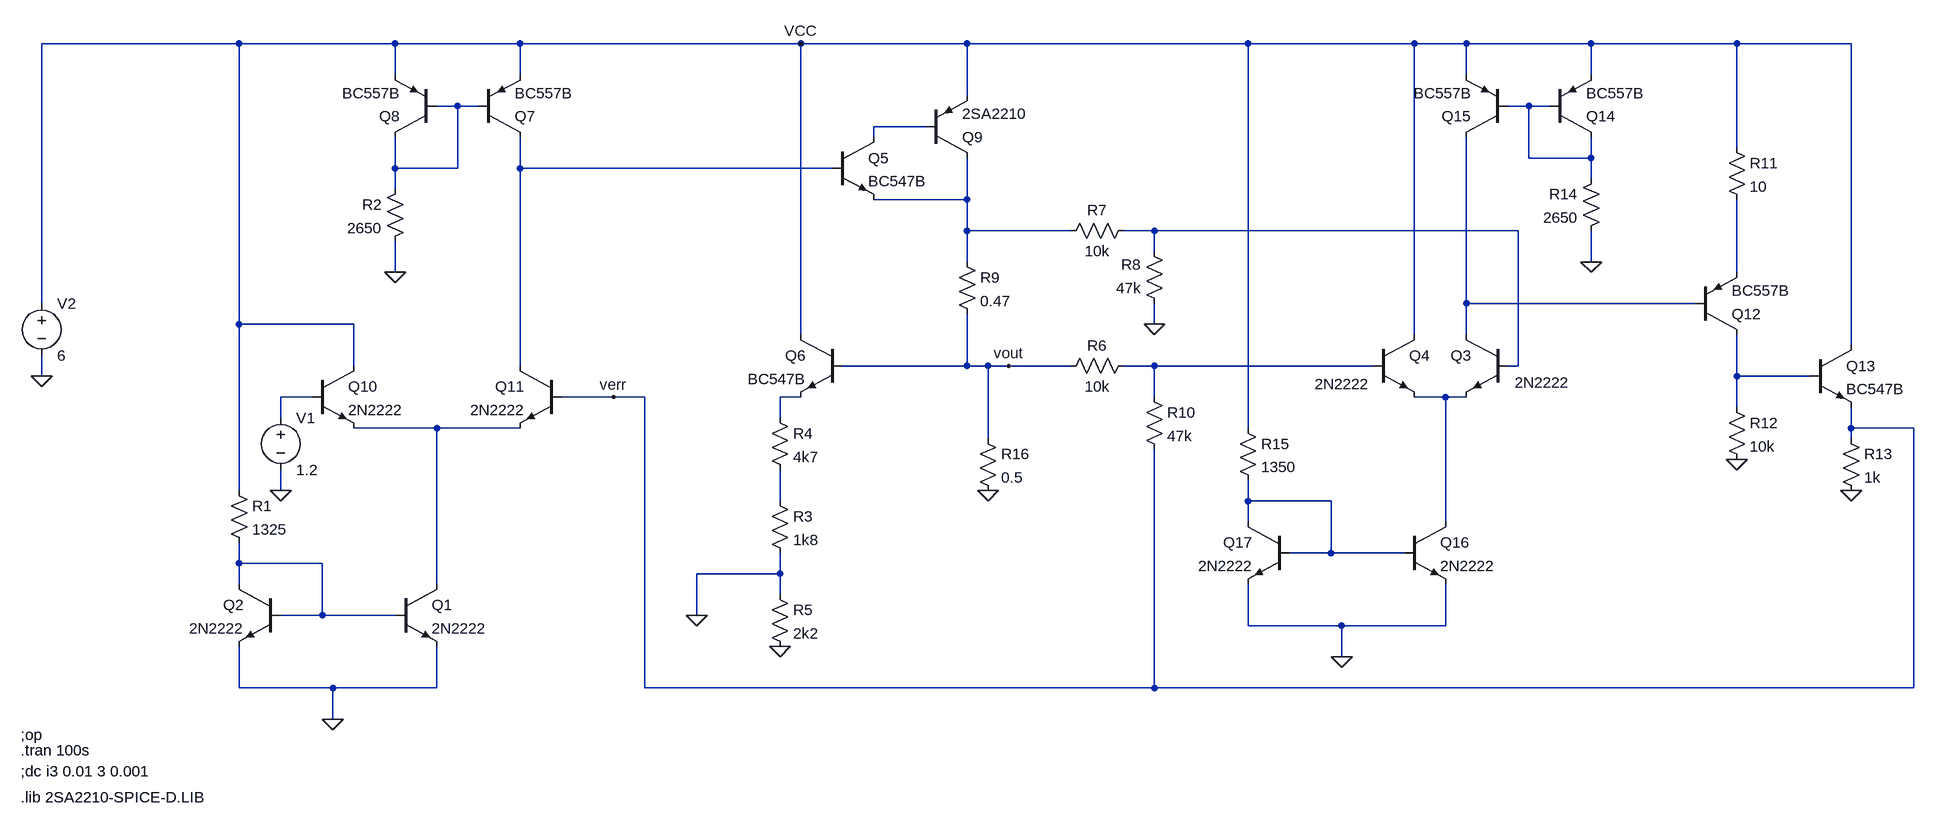
[diagram p0: schematic modelo_1_2_discrete.asc]
modelo_1_2_discrete.asc, the LTspice schematic file:
Version 4
SHEET 1 3060 680
WIRE -128 -496 -432 -496
WIRE 112 -496 -128 -496
WIRE 304 -496 112 -496
WIRE 736 -496 304 -496
WIRE 992 -496 736 -496
WIRE 1424 -496 992 -496
WIRE 1680 -496 1424 -496
WIRE 1760 -496 1680 -496
WIRE 1952 -496 1760 -496
WIRE 2176 -496 1952 -496
WIRE 2352 -496 2176 -496
WIRE 112 -448 112 -496
WIRE 304 -448 304 -496
WIRE 1760 -448 1760 -496
WIRE 1952 -448 1952 -496
WIRE 992 -416 992 -496
WIRE 208 -400 176 -400
WIRE 240 -400 208 -400
WIRE 1856 -400 1824 -400
WIRE 1888 -400 1856 -400
WIRE 928 -368 848 -368
WIRE 848 -352 848 -368
WIRE 2176 -336 2176 -496
WIRE 1856 -320 1856 -400
WIRE 1952 -320 1952 -352
WIRE 1952 -320 1856 -320
WIRE 112 -304 112 -352
WIRE 208 -304 208 -400
WIRE 208 -304 112 -304
WIRE 304 -304 304 -352
WIRE 784 -304 304 -304
WIRE 1952 -288 1952 -320
WIRE 112 -272 112 -304
WIRE 992 -256 992 -320
WIRE 992 -256 848 -256
WIRE 992 -208 992 -256
WIRE 1152 -208 992 -208
WIRE 1280 -208 1232 -208
WIRE 1840 -208 1280 -208
WIRE 1280 -176 1280 -208
WIRE 992 -160 992 -208
WIRE 1952 -160 1952 -208
WIRE 112 -144 112 -192
WIRE 2176 -144 2176 -256
WIRE -432 -96 -432 -496
WIRE 1760 -96 1760 -352
WIRE 2112 -96 1760 -96
WIRE -128 -64 -128 -496
WIRE 48 -64 -128 -64
WIRE 1280 -64 1280 -96
WIRE 736 -48 736 -496
WIRE 1680 -48 1680 -496
WIRE 1760 -48 1760 -96
WIRE 2352 -32 2352 -496
WIRE 48 0 48 -64
WIRE 304 0 304 -304
WIRE 992 0 992 -80
WIRE 992 0 800 0
WIRE 1024 0 992 0
WIRE 1056 0 1024 0
WIRE 1152 0 1056 0
WIRE 1280 0 1232 0
WIRE 1616 0 1280 0
WIRE 1840 0 1840 -208
WIRE 1840 0 1824 0
WIRE -432 16 -432 -16
WIRE 2176 16 2176 -48
WIRE 2288 16 2176 16
WIRE -16 48 -64 48
WIRE 448 48 368 48
WIRE 496 48 448 48
WIRE 736 48 704 48
WIRE 1280 48 1280 0
WIRE 1728 48 1680 48
WIRE 1760 48 1728 48
WIRE 2176 64 2176 16
WIRE -64 80 -64 48
WIRE 704 80 704 48
WIRE 176 96 48 96
WIRE 304 96 176 96
WIRE 1424 96 1424 -496
WIRE 2352 96 2352 64
WIRE 2448 96 2352 96
WIRE 1024 112 1024 0
WIRE 2352 112 2352 96
WIRE -128 192 -128 -64
WIRE -64 192 -64 160
WIRE 704 208 704 160
WIRE 1424 208 1424 176
WIRE 1552 208 1424 208
WIRE 1424 240 1424 208
WIRE 1728 240 1728 48
WIRE 1552 288 1552 208
WIRE 1552 288 1488 288
WIRE 1664 288 1552 288
WIRE -128 304 -128 272
WIRE 0 304 -128 304
WIRE 704 320 704 288
WIRE 704 320 576 320
WIRE -128 336 -128 304
WIRE 176 336 176 96
WIRE 704 352 704 320
WIRE 0 384 0 304
WIRE 0 384 -64 384
WIRE 112 384 0 384
WIRE 576 384 576 320
WIRE 1424 400 1424 336
WIRE 1568 400 1424 400
WIRE 1728 400 1728 336
WIRE 1728 400 1568 400
WIRE 1568 448 1568 400
WIRE -128 496 -128 432
WIRE 16 496 -128 496
WIRE 176 496 176 432
WIRE 176 496 16 496
WIRE 496 496 496 48
WIRE 1280 496 1280 128
WIRE 1280 496 496 496
WIRE 2448 496 2448 96
WIRE 2448 496 1280 496
WIRE 16 544 16 496
FLAG 16 544 0
FLAG -64 192 0
FLAG -432 16 0
FLAG 112 -144 0
FLAG 1056 0 vout
FLAG 448 48 verr
FLAG 1024 192 0
FLAG 704 432 0
FLAG 736 -496 VCC
FLAG 576 384 0
FLAG 1280 -64 0
FLAG 2176 144 0
FLAG 2352 192 0
FLAG 1952 -160 0
FLAG 1568 448 0
SYMBOL npn 112 336 R0
SYMATTR InstName Q1
SYMATTR Value 2N2222
SYMBOL npn -64 336 M0
SYMATTR InstName Q2
SYMATTR Value 2N2222
SYMBOL npn 784 -352 R0
SYMATTR InstName Q5
SYMATTR Value BC547B
SYMBOL pnp 240 -352 M180
SYMATTR InstName Q7
SYMATTR Value BC557B
SYMBOL pnp 176 -352 R180
SYMATTR InstName Q8
SYMATTR Value BC557B
SYMBOL res -144 176 R0
SYMATTR InstName R1
SYMATTR Value 1325
SYMBOL res 128 -288 M0
SYMATTR InstName R2
SYMATTR Value 2650
SYMBOL pnp 928 -320 M180
SYMATTR InstName Q9
SYMATTR Value 2SA2210
SYMBOL voltage -64 64 R0
WINDOW 123 0 0 Left 0
WINDOW 39 0 0 Left 0
SYMATTR InstName V1
SYMATTR Value 1.2
SYMBOL voltage -432 -112 R0
WINDOW 123 0 0 Left 0
WINDOW 39 0 0 Left 0
SYMATTR InstName V2
SYMATTR Value 6
SYMBOL npn 800 -48 M0
SYMATTR InstName Q6
SYMATTR Value BC547B
SYMBOL res 688 64 R0
SYMATTR InstName R4
SYMATTR Value 4k7
SYMBOL res 688 192 R0
SYMATTR InstName R3
SYMATTR Value 1k8
SYMBOL res 688 336 R0
SYMATTR InstName R5
SYMATTR Value 2k2
SYMBOL res 976 -176 R0
SYMATTR InstName R9
SYMATTR Value 0.47
SYMBOL npn -16 0 R0
SYMATTR InstName Q10
SYMATTR Value 2N2222
SYMBOL npn 368 0 M0
SYMATTR InstName Q11
SYMATTR Value 2N2222
SYMBOL res 1248 -16 R90
WINDOW 0 0 56 VBottom 2
WINDOW 3 32 56 VTop 2
SYMATTR InstName R6
SYMATTR Value 10k
SYMBOL res 1248 -224 R90
WINDOW 0 0 56 VBottom 2
WINDOW 3 32 56 VTop 2
SYMATTR InstName R7
SYMATTR Value 10k
SYMBOL res 1296 -80 R180
WINDOW 0 36 76 Left 2
WINDOW 3 36 40 Left 2
SYMATTR InstName R8
SYMATTR Value 47k
SYMBOL res 1264 32 R0
SYMATTR InstName R10
SYMATTR Value 47k
SYMBOL npn 1824 -48 M0
WINDOW 3 -95 74 Left 2
SYMATTR InstName Q3
SYMATTR Value 2N2222
SYMBOL npn 1616 -48 R0
WINDOW 3 -89 76 Left 2
SYMATTR InstName Q4
SYMATTR Value 2N2222
SYMBOL pnp 2112 -48 M180
SYMATTR InstName Q12
SYMATTR Value BC557B
SYMBOL res 2160 -352 R0
SYMATTR InstName R11
SYMATTR Value 10
SYMBOL res 2160 48 R0
SYMATTR InstName R12
SYMATTR Value 10k
SYMBOL npn 2288 -32 R0
SYMATTR InstName Q13
SYMATTR Value BC547B
SYMBOL res 2336 96 R0
SYMATTR InstName R13
SYMATTR Value 1k
SYMBOL pnp 1888 -352 M180
SYMATTR InstName Q14
SYMATTR Value BC557B
SYMBOL pnp 1824 -352 R180
SYMATTR InstName Q15
SYMATTR Value BC557B
SYMBOL res 1968 -304 M0
SYMATTR InstName R14
SYMATTR Value 2650
SYMBOL npn 1664 240 R0
SYMATTR InstName Q16
SYMATTR Value 2N2222
SYMBOL npn 1488 240 M0
SYMATTR InstName Q17
SYMATTR Value 2N2222
SYMBOL res 1408 80 R0
SYMATTR InstName R15
SYMATTR Value 1350
SYMBOL res 1008 96 R0
SYMATTR InstName R16
SYMATTR Value 0.5
TEXT -464 568 Left 2 !;op
TEXT -464 592 Left 2 !.tran 100s
TEXT -464 624 Left 2 !;dc i3 0.01 3 0.001
TEXT -464 664 Left 2 !.lib 2SA2210-SPICE-D.LIB

The netlist it stands for:
* modelo_1_2_discrete.asc
Q1 N014 N017 0 0 2N2222
Q2 N017 N017 0 0 2N2222
Q5 N003 N004 N005 0 BC547B
Q7 N004 N001 VCC 0 BC557B
Q8 N001 N001 VCC 0 BC557B
R1 VCC N017 1325
R2 N001 0 2650
Q9 N005 N003 VCC 0 2SA2210
V1 N011 0 1.2
V2 VCC 0 6
Q6 VCC vout N012 0 BC547B
R4 N012 N015 4k7
R3 N015 0 1k8
R5 0 0 2k2
R9 N005 vout 0.47
Q10 VCC N011 N014 0 2N2222
Q11 N004 verr N014 0 2N2222
R6 N009 vout 10k
R7 N006 N005 10k
R8 0 N006 47k
R10 N009 verr 47k
Q3 N008 N006 N013 0 2N2222
Q4 VCC N009 N013 0 2N2222
Q12 N010 N008 N007 0 BC557B
R11 VCC N007 10
R12 N010 0 10k
Q13 VCC N010 verr 0 BC547B
R13 verr 0 1k
Q14 N002 N002 VCC 0 BC557B
Q15 N008 N002 VCC 0 BC557B
R14 N002 0 2650
Q16 N013 N016 0 0 2N2222
Q17 N016 N016 0 0 2N2222
R15 VCC N016 1350
R16 vout 0 0.5
.model NPN NPN
.model PNP PNP
.lib standard.bjt
;op
.tran 100s
;dc i3 0.01 3 0.001
.lib 2SA2210-SPICE-D.LIB
.backanno
.end